# Altium schematic sheet ESP8266.SchDoc
size A4
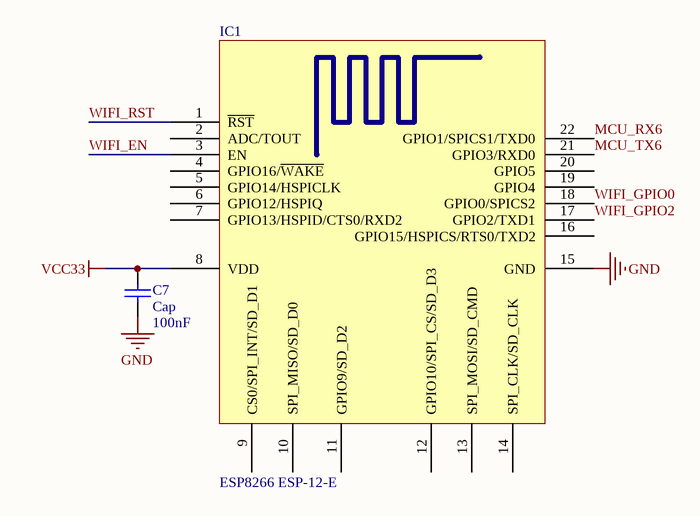
[diagram p0: ESP8266.SchDoc]

## Parts
C7  Cap  value 100nF  [C0603]
IC1  ESP8266 ESP-12-E  [ESP8266 ESP-12-E]

## Nets
GND: C7.1 IC1.15(GND)
VCC33: C7.2 IC1.8(VDD)
MCU_RX6: IC1.22(GPIO1/SPICS1/TXD0)
MCU_TX6: IC1.21(GPIO3/RXD0)
WIFI_EN: IC1.3(EN)
WIFI_GPIO0: IC1.18(GPIO0/SPICS2)
WIFI_GPIO2: IC1.17(GPIO2/TXD1)
WIFI_RST: IC1.1(~{RST})

Not connected (* = marked no-connect by the designer): IC1 2(ADC/TOUT) 4(GPIO16/~{WAKE}) 5(GPIO14/HSPICLK) 6(GPIO12/HSPIQ) 7(GPIO13/HSPID/CTS0/RXD2) 9(CS0/SPI_INT/SD_D1) 10(SPI_MISO/SD_D0) 11(GPIO9/SD_D2) 12(GPIO10/SPI_CS/SD_D3) 13(SPI_MOSI/SD_CMD) 14(SPI_CLK/SD_CLK) 16(GPIO15/HSPICS/RTS0/TXD2) 19(GPIO4) 20(GPIO5)

## Library data of the parts
C7 = Cap: Capacitor; Published: 8-Jun-2000; LatestRevisionDate: 17-Jul-2002; LatestRevisionNote: Re-released for DXP Platform.; PackageReference: RAD-0.3; Publisher: Altium Limited; PackageDescription: Radial Cap, Thru-Hole; 2 Leads; 0.3 in Pin Spacing